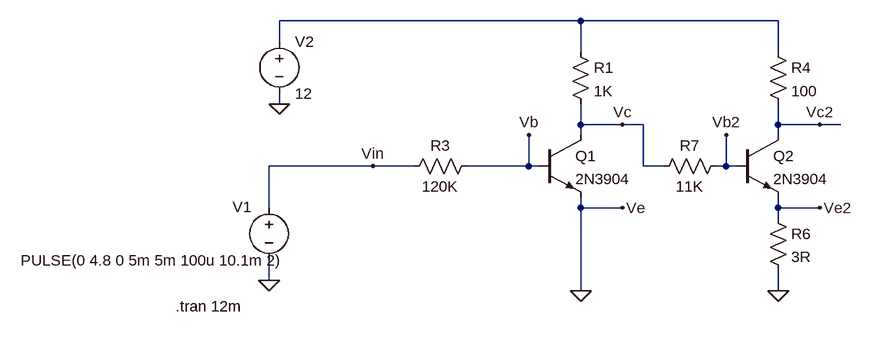
[diagram p0: schematic PWM 2N3904 Amplifier.asc]
PWM 2N3904 Amplifier.asc, the LTspice schematic file:
Version 4
SHEET 1 1388 680
WIRE 192 -48 -272 -48
WIRE 496 -48 192 -48
WIRE -272 -16 -272 -48
WIRE 192 0 192 -48
WIRE 496 0 496 -48
WIRE -272 80 -272 64
WIRE 192 112 192 80
WIRE 256 112 192 112
WIRE 288 112 256 112
WIRE 496 112 496 80
WIRE 560 112 496 112
WIRE 592 112 560 112
WIRE 192 128 192 112
WIRE 496 128 496 112
WIRE -128 176 -288 176
WIRE -64 176 -128 176
WIRE 112 176 112 128
WIRE 112 176 16 176
WIRE 128 176 112 176
WIRE 288 176 288 112
WIRE 320 176 288 176
WIRE 416 176 416 128
WIRE 416 176 400 176
WIRE 432 176 416 176
WIRE -288 240 -288 176
WIRE 192 240 192 224
WIRE 256 240 192 240
WIRE 496 240 496 224
WIRE 560 240 496 240
WIRE 496 256 496 240
WIRE -288 352 -288 320
WIRE 192 368 192 240
WIRE 496 368 496 336
FLAG -272 80 0
FLAG -288 352 0
FLAG 192 368 0
FLAG 256 112 Vc
FLAG 256 240 Ve
FLAG 112 128 Vb
FLAG 496 368 0
FLAG 560 112 Vc2
FLAG 560 240 Ve2
FLAG 416 128 Vb2
FLAG -128 176 Vin
SYMBOL npn 128 128 R0
SYMATTR InstName Q1
SYMATTR Value 2N3904
SYMBOL voltage -288 224 R0
WINDOW 0 -56 15 Left 2
WINDOW 3 -382 97 Left 2
WINDOW 123 0 0 Left 0
WINDOW 39 0 0 Left 0
SYMATTR InstName V1
SYMATTR Value PULSE(0 4.8 0 5m 5m 100u 10.1m 2)
SYMBOL voltage -272 -32 R0
WINDOW 123 0 0 Left 0
WINDOW 39 0 0 Left 0
SYMATTR InstName V2
SYMATTR Value 12
SYMBOL res 176 -16 R0
SYMATTR InstName R1
SYMATTR Value 1K
SYMBOL res 32 160 R90
WINDOW 0 0 56 VBottom 2
WINDOW 3 32 56 VTop 2
SYMATTR InstName R3
SYMATTR Value 120K
SYMBOL npn 432 128 R0
SYMATTR InstName Q2
SYMATTR Value 2N3904
SYMBOL res 480 -16 R0
SYMATTR InstName R4
SYMATTR Value 100
SYMBOL res 480 240 R0
SYMATTR InstName R6
SYMATTR Value 3R
SYMBOL res 416 160 R90
WINDOW 0 0 56 VBottom 2
WINDOW 3 32 56 VTop 2
SYMATTR InstName R7
SYMATTR Value 11K
TEXT -432 392 Left 2 !.tran 12m

The netlist it stands for:
* PWM 2N3904 Amplifier.asc
Q1 Vc Vb 0 0 2N3904
V1 Vin 0 PULSE(0 4.8 0 5m 5m 100u 10.1m 2)
V2 N001 0 12
R1 N001 Vc 1K
R3 Vb Vin 120K
Q2 Vc2 Vb2 Ve2 0 2N3904
R4 N001 Vc2 100
R6 Ve2 0 3R
R7 Vb2 Vc 11K
.model NPN NPN
.model PNP PNP
.lib standard.bjt
.tran 12m
.backanno
.end